# EAGLE design breakout2.1 (EAGLE 8.7.0)
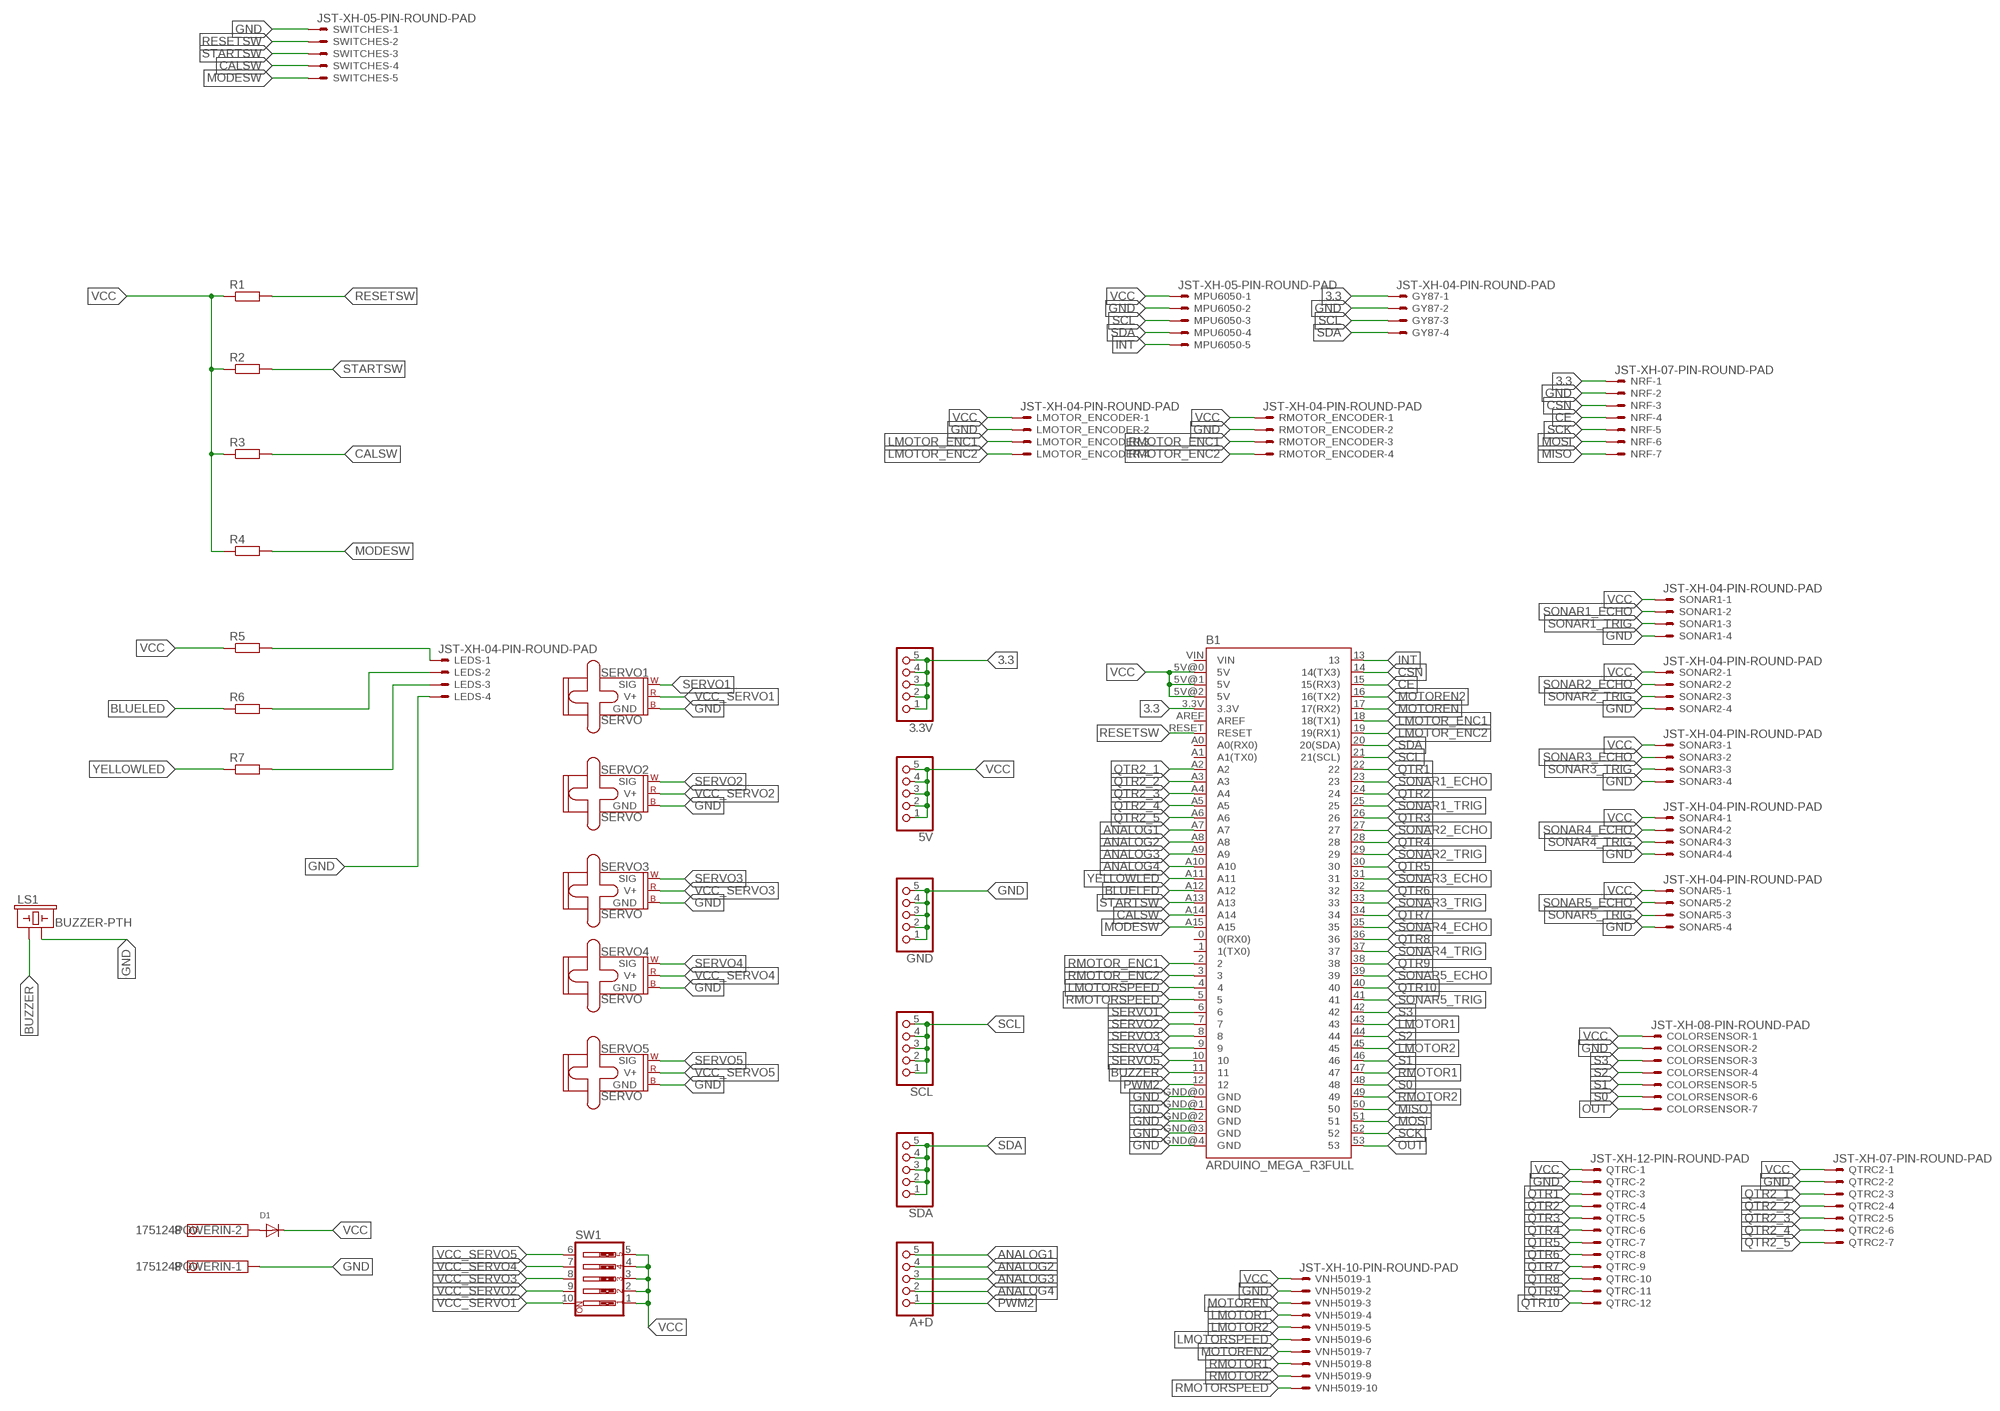
[diagram p0: schematic, sheet 1]

## Parts
3.3V  PINHD-1X55X2MM  [1_05X2MM]
5V  PINHD-1X55X2MM  [1_05X2MM]
A+D  PINHD-1X55X2MM  [1_05X2MM]
B1  ARDUINO_MEGA_R3FULL  [ARDUINO_MEGA]
COLORSENSOR  JST-XH-08-PIN-ROUND-PAD  [JST-XH-08-PACKAGE-ROUND-PAD]
D1  DIODEDO-1N4148  [DO-1N4148]
GND  PINHD-1X55X2MM  [1_05X2MM]
GY87  JST-XH-04-PIN-ROUND-PAD  [JST-XH-04-PACKAGE-ROUND-PAD]
LEDS  JST-XH-04-PIN-ROUND-PAD  [JST-XH-04-PACKAGE-ROUND-PAD]
LMOTOR_ENCODER  JST-XH-04-PIN-ROUND-PAD  [JST-XH-04-PACKAGE-ROUND-PAD]
LS1  BUZZER-PTH  [BUZZER-12MM]
MPU6050  JST-XH-05-PIN-ROUND-PAD  [JST-XH-05-PACKAGE-ROUND-PAD]
NRF  JST-XH-07-PIN-ROUND-PAD  [JST-XH-07-PACKAGE-ROUND-PAD]
POWERIN  1751248  [1751248]
QTRC  JST-XH-12-PIN-ROUND-PAD  [JST-XH-12-PACKAGE-ROUND-PAD]
QTRC2  JST-XH-07-PIN-ROUND-PAD  [JST-XH-07-PACKAGE-ROUND-PAD]
R1  R-EU_0204/7  [0204/7]
R2  R-EU_0204/7  [0204/7]
R3  R-EU_0204/7  [0204/7]
R4  R-EU_0204/7  [0204/7]
R5  R-EU_0204/7  [0204/7]
R6  R-EU_0204/7  [0204/7]
R7  R-EU_0204/7  [0204/7]
RMOTOR_ENCODER  JST-XH-04-PIN-ROUND-PAD  [JST-XH-04-PACKAGE-ROUND-PAD]
SCL  PINHD-1X55X2MM  [1_05X2MM]
SDA  PINHD-1X55X2MM  [1_05X2MM]
SERVO1  SERVO  [1X03]
SERVO2  SERVO  [1X03]
SERVO3  SERVO  [1X03]
SERVO4  SERVO  [1X03]
SERVO5  SERVO  [1X03]
SONAR1  JST-XH-04-PIN-ROUND-PAD  [JST-XH-04-PACKAGE-ROUND-PAD]
SONAR2  JST-XH-04-PIN-ROUND-PAD  [JST-XH-04-PACKAGE-ROUND-PAD]
SONAR3  JST-XH-04-PIN-ROUND-PAD  [JST-XH-04-PACKAGE-ROUND-PAD]
SONAR4  JST-XH-04-PIN-ROUND-PAD  [JST-XH-04-PACKAGE-ROUND-PAD]
SONAR5  JST-XH-04-PIN-ROUND-PAD  [JST-XH-04-PACKAGE-ROUND-PAD]
SW1  SW_DIP-5  [EDG-05]
SWITCHES  JST-XH-05-PIN-ROUND-PAD  [JST-XH-05-PACKAGE-ROUND-PAD]
VNH5019  JST-XH-10-PIN-ROUND-PAD  [JST-XH-10-PACKAGE-ROUND-PAD]

## Nets
3.3: 3.3V.1 3.3V.2 3.3V.3 3.3V.4 3.3V.5 B1.3.3V GY87.1 NRF.1
ANALOG1: A+D.5 B1.A7
ANALOG2: A+D.4 B1.A8
ANALOG3: A+D.3 B1.A9
ANALOG4: A+D.2 B1.A10
BLUELED: B1.A12 R6.1
BUZZER: B1.11 LS1.+
CALSW: B1.A14 R3.2 SWITCHES.4
CE: B1.15(15(RX3)) NRF.4
CSN: B1.14(14(TX3)) NRF.3
GND: B1.GND@0(GND) B1.GND@1(GND) B1.GND@2(GND) B1.GND@3(GND) B1.GND@4(GND) COLORSENSOR.2 GND.1 GND.2 GND.3 GND.4 GND.5 GY87.2 LEDS.4 LMOTOR_ENCODER.2 LS1.- MPU6050.2 NRF.2 POWERIN.1 QTRC2.2 QTRC.2 RMOTOR_ENCODER.2 SERVO1.3(GND) SERVO2.3(GND) SERVO3.3(GND) SERVO4.3(GND) SERVO5.3(GND) SONAR1.4 SONAR2.4 SONAR3.4 SONAR4.4 SONAR5.4 SWITCHES.1 VNH5019.2
INT: B1.13 MPU6050.5
LMOTOR1: B1.43 VNH5019.4
LMOTOR2: B1.45 VNH5019.5
LMOTOR_ENC1: B1.18(18(TX1)) LMOTOR_ENCODER.3
LMOTOR_ENC2: B1.19(19(RX1)) LMOTOR_ENCODER.4
LMOTORSPEED: B1.4 VNH5019.6
MISO: B1.50 NRF.7
MODESW: B1.A15 R4.2 SWITCHES.5
MOSI: B1.51 NRF.6
MOTOREN: B1.17(17(RX2)) VNH5019.3
MOTOREN2: B1.16(16(TX2)) VNH5019.7
N$1: D1.A POWERIN.2
N$3: LEDS.2 R6.2
N$5: LEDS.3 R7.2
N$6: LEDS.1 R5.2
OUT: B1.53 COLORSENSOR.7
PWM2: A+D.1 B1.12
QTR1: B1.22 QTRC.3
QTR2: B1.24 QTRC.4
QTR2_1: B1.A2 QTRC2.3
QTR2_2: B1.A3 QTRC2.4
QTR2_3: B1.A4 QTRC2.5
QTR2_4: B1.A5 QTRC2.6
QTR2_5: B1.A6 QTRC2.7
QTR3: B1.26 QTRC.5
QTR4: B1.28 QTRC.6
QTR5: B1.30 QTRC.7
QTR6: B1.32 QTRC.8
QTR7: B1.34 QTRC.9
QTR8: B1.36 QTRC.10
QTR9: B1.38 QTRC.11
QTR10: B1.40 QTRC.12
RESETSW: B1.RESET R1.2 SWITCHES.2
RMOTOR1: B1.47 VNH5019.8
RMOTOR2: B1.49 VNH5019.9
RMOTOR_ENC1: B1.2 RMOTOR_ENCODER.3
RMOTOR_ENC2: B1.3 RMOTOR_ENCODER.4
RMOTORSPEED: B1.5 VNH5019.10
S0: B1.48 COLORSENSOR.6
S1: B1.46 COLORSENSOR.5
S2: B1.44 COLORSENSOR.4
S3: B1.42 COLORSENSOR.3
SCK: B1.52 NRF.5
SCL: B1.21(21(SCL)) GY87.3 MPU6050.3 SCL.1 SCL.2 SCL.3 SCL.4 SCL.5
SDA: B1.20(20(SDA)) GY87.4 MPU6050.4 SDA.1 SDA.2 SDA.3 SDA.4 SDA.5
SERVO1: B1.6 SERVO1.1(SIG)
SERVO2: B1.7 SERVO2.1(SIG)
SERVO3: B1.8 SERVO3.1(SIG)
SERVO4: B1.9 SERVO4.1(SIG)
SERVO5: B1.10 SERVO5.1(SIG)
SONAR1_ECHO: B1.23 SONAR1.2
SONAR1_TRIG: B1.25 SONAR1.3
SONAR2_ECHO: B1.27 SONAR2.2
SONAR2_TRIG: B1.29 SONAR2.3
SONAR3_ECHO: B1.31 SONAR3.2
SONAR3_TRIG: B1.33 SONAR3.3
SONAR4_ECHO: B1.35 SONAR4.2
SONAR4_TRIG: B1.37 SONAR4.3
SONAR5_ECHO: B1.39 SONAR5.2
SONAR5_TRIG: B1.41 SONAR5.3
STARTSW: B1.A13 R2.2 SWITCHES.3
VCC: 5V.1 5V.2 5V.3 5V.4 5V.5 B1.5V@0(5V) B1.5V@1(5V) B1.5V@2(5V) COLORSENSOR.1 D1.C LMOTOR_ENCODER.1 MPU6050.1 QTRC2.1 QTRC.1 R1.1 R2.1 R3.1 R4.1 R5.1 RMOTOR_ENCODER.1 SONAR1.1 SONAR2.1 SONAR3.1 SONAR4.1 SONAR5.1 SW1.1 SW1.2 SW1.3 SW1.4 SW1.5 VNH5019.1
VCC_SERVO1: SERVO1.2(V+) SW1.10
VCC_SERVO2: SERVO2.2(V+) SW1.9
VCC_SERVO3: SERVO3.2(V+) SW1.8
VCC_SERVO4: SERVO4.2(V+) SW1.7
VCC_SERVO5: SERVO5.2(V+) SW1.6
YELLOWLED: B1.A11 R7.1
Unconnected: B1.0(0(RX0)) B1.1(1(TX0)) B1.A0(A0(RX0)) B1.A1(A1(TX0)) B1.AREF B1.VIN COLORSENSOR.8

## Library data of the parts
3.3V 5V A+D GND SCL SDA = pinhead:PINHD-1X5: PIN HEADER
B1 = SparkFun-Boards:ARDUINO_MEGA_R3: Arduino Mega R3 ATmega2560 R3 compatible footprint. SparkFun Products: Arduino Mega 2560 R3 <https://www.sparkfun.com/products/11061>
COLORSENSOR = Rembrandt Electronics - JST XH Connectors v1-0:JST-XH-08-PIN: JST XH Connector 2 Pin Wire to board connector. Pitch: 2,54 mm, (0.100") Number of pins: 8 Created by Rembrandt Electronics www.rembrandtelectronics.com
D1 = adafruit:DIODE: Diode SMADIODE - SMA Surface Mount Package 20V 1A Schottky Diode Digikey: 641-1014-6-ND DO-1N4148 - Through Hole Small Current Diode SOD-123 20V 1 A (.5mV Vf) Schottky Diode - Digikey: MBRX120TPMSCT-ND SOD-323 10V 570mA (.38mV Vf, 3ns) Schottky Diode - Digikey: ZLLS410CT-ND SOD-523 30V 30mA Schottky Diode (RB751S-40TE61) - Digikey: RB751S-40TE61CT-ND SOT23-R/W - SOT23 Package (R = Solder Paste/Reflow Ovens, W = Hand-Soldering) BAT54Film 40V 300mA - Digikey: 497-7162-1-ND
GY87 LEDS LMOTOR_ENCODER RMOTOR_ENCODER SONAR1-SONAR5 = Rembrandt Electronics - JST XH Connectors v1-0:JST-XH-04-PIN: JST XH Connector 2 Pin Wire to board connector. Pitch: 2,54 mm, (0.100") Number of pins: 4 Created by Rembrandt Electronics www.rembrandtelectronics.com
LS1 = SparkFun-Electromechanical:BUZZER: Buzzer Small round buzzers that operate around the audible 2kHz range. You can use these as speakers to create simple music or user interfaces. Variant Overview: PTH - Mini Speaker - PC Mount 12mm 2.048kHz <https://www.sparkfun.com/products/7950> PTH_KIT - Mini Speaker - PC Mount 12mm 2.048kHz <https://www.sparkfun.com/products/7950> KIT simplifies soldering by adding stop mask to one side of the pads. PTH_NO_SILK - Mini Speaker - PC Mount 12mm 2.048kHz <https://www.sparkfun.com/products/7950> No silkscreen indicator of buzzer outline. PTH_KIT_NO_SILK - Mini Speaker - PC Mount 12mm 2.048kHz <https://www.sparkfun.com/products/7950> KIT package w/o silkscreen SMD - Buzzer Audio Magnetic (CCV-084B16) SMD buzzer used on, e.g. the LilyPad Buzzer <https://www.sparkfun.com/products/8463> and RFID USB Reader <https://www.sparkfun.com/products/9963>. SMD_KIT - Buzzer Audio Magnetic (CCV-084B16) SMD Buzzer with elongated pins to make soldering easier. Used on the SparkFun Simon Says - Surface Mount Soldering Kit <https://www.sparkfun.com/products/10935>.; PROD_ID: COMP-08253; SF_SKU: COM-07950
MPU6050 SWITCHES = Rembrandt Electronics - JST XH Connectors v1-0:JST-XH-05-PIN: JST XH Connector 2 Pin Wire to board connector. Pitch: 2,54 mm, (0.100") Number of pins: 5 Created by Rembrandt Electronics www.rembrandtelectronics.com
NRF QTRC2 = Rembrandt Electronics - JST XH Connectors v1-0:JST-XH-07-PIN: JST XH Connector 2 Pin Wire to board connector. Pitch: 2,54 mm, (0.100") Number of pins: 7 Created by Rembrandt Electronics www.rembrandtelectronics.com
POWERIN = con-phoenix-350:1751248: MKDS 1/ 2-3,5 Printklemme Nennstrom: 10 A Bemessungsspannung: 160 V Raster: 3,5 mm Polzahl: 2 Montageart: Löten Anschlussart: Schraubanschluss Anschlussrichtung vom Leiter zur Platine: 0° Source: http://eshop.phoenixcontact.com .. 1751248.pdf; OC_FARNELL: unknown; OC_NEWARK: unknown
QTRC = Rembrandt Electronics - JST XH Connectors v1-0:JST-XH-12-PIN: JST XH Connector 2 Pin Wire to board connector. Pitch: 2,54 mm, (0.100") Number of pins: 12 Created by Rembrandt Electronics www.rembrandtelectronics.com
R1-R7 = rcl:R-EU_: RESISTOR, European symbol
SERVO1-SERVO5 = SparkFun-Electromechanical:SERVO: Servo Motor 3-pin connector for a standard servo motor (voltage supply, ground, and control signal.) SparkFun Products Servo - Generic (Sub-Micro Size) <https://www.sparkfun.com/products/9065> (ROB-09065) Servo - Generic High Torque Continuous Rotation (Standard Size) <https://www.sparkfun.com/products/9347> (ROB-09347) Servo - Generic High Torque (Standard Size) <https://www.sparkfun.com/products/11965> (ROB-11965)
SW1 = special:SW_DIP-5: DIP SWITCH
VNH5019 = Rembrandt Electronics - JST XH Connectors v1-0:JST-XH-10-PIN: JST XH Connector 2 Pin Wire to board connector. Pitch: 2,54 mm, (0.100") Number of pins: 10 Created by Rembrandt Electronics www.rembrandtelectronics.com

## Board
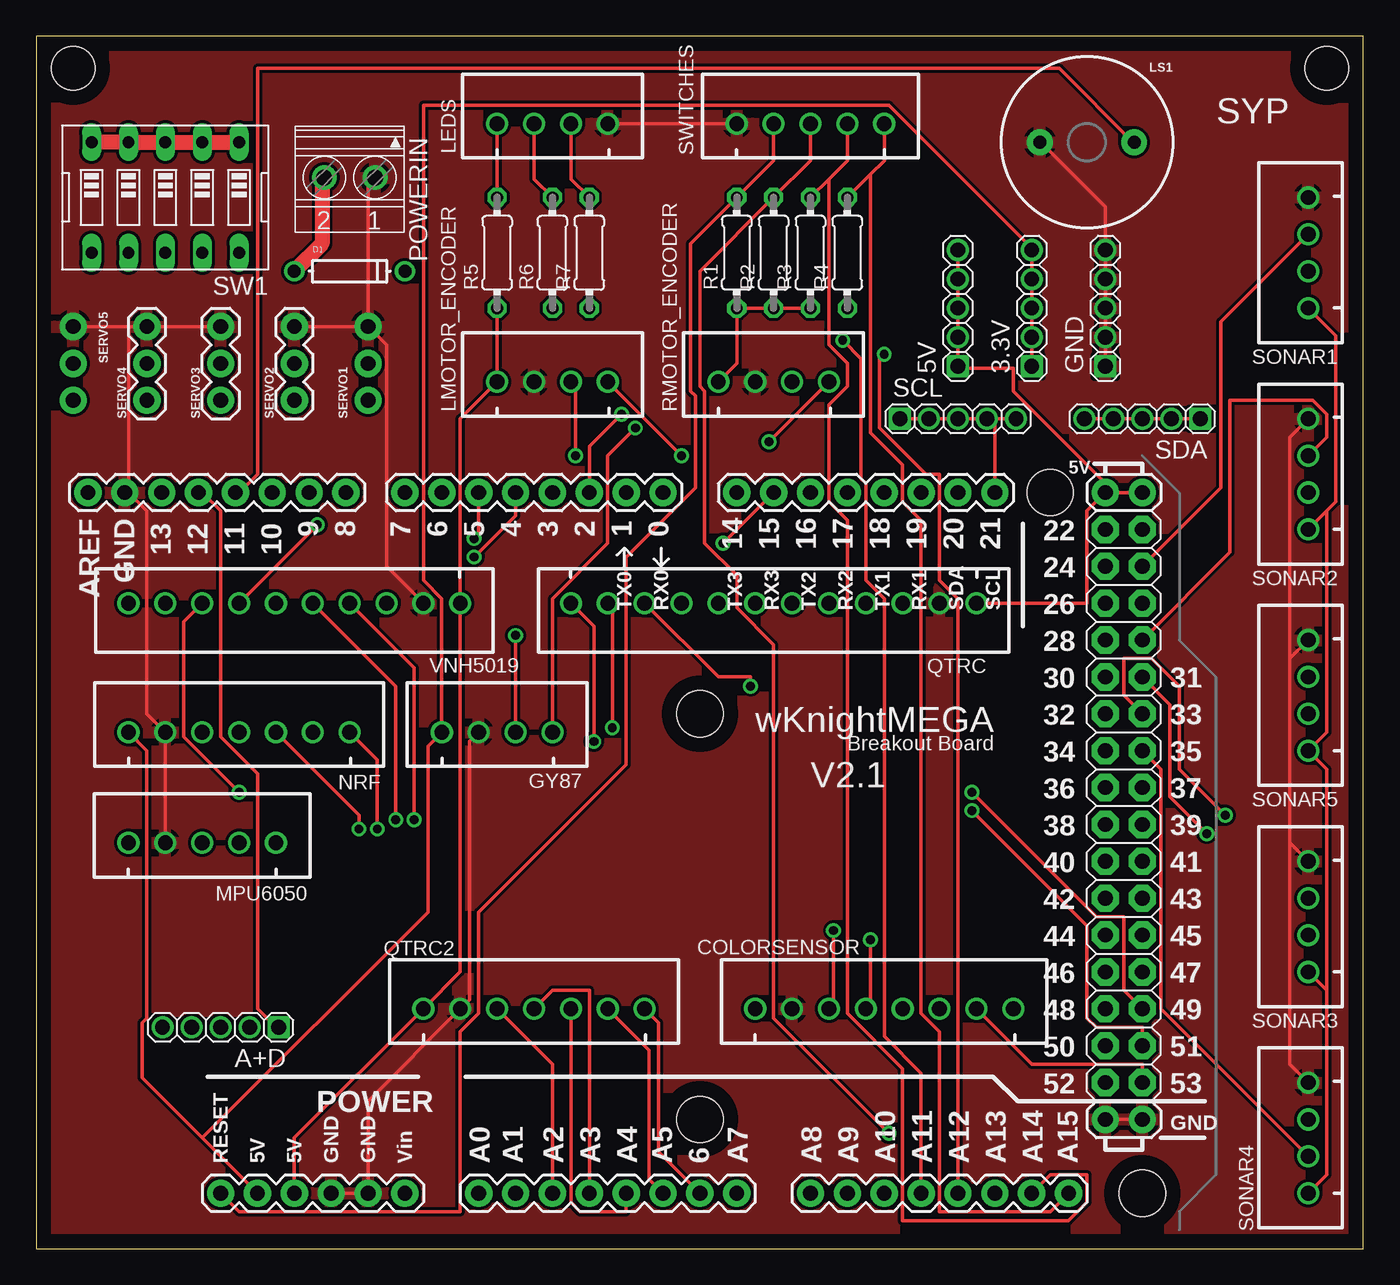
[diagram p1: board, top side]
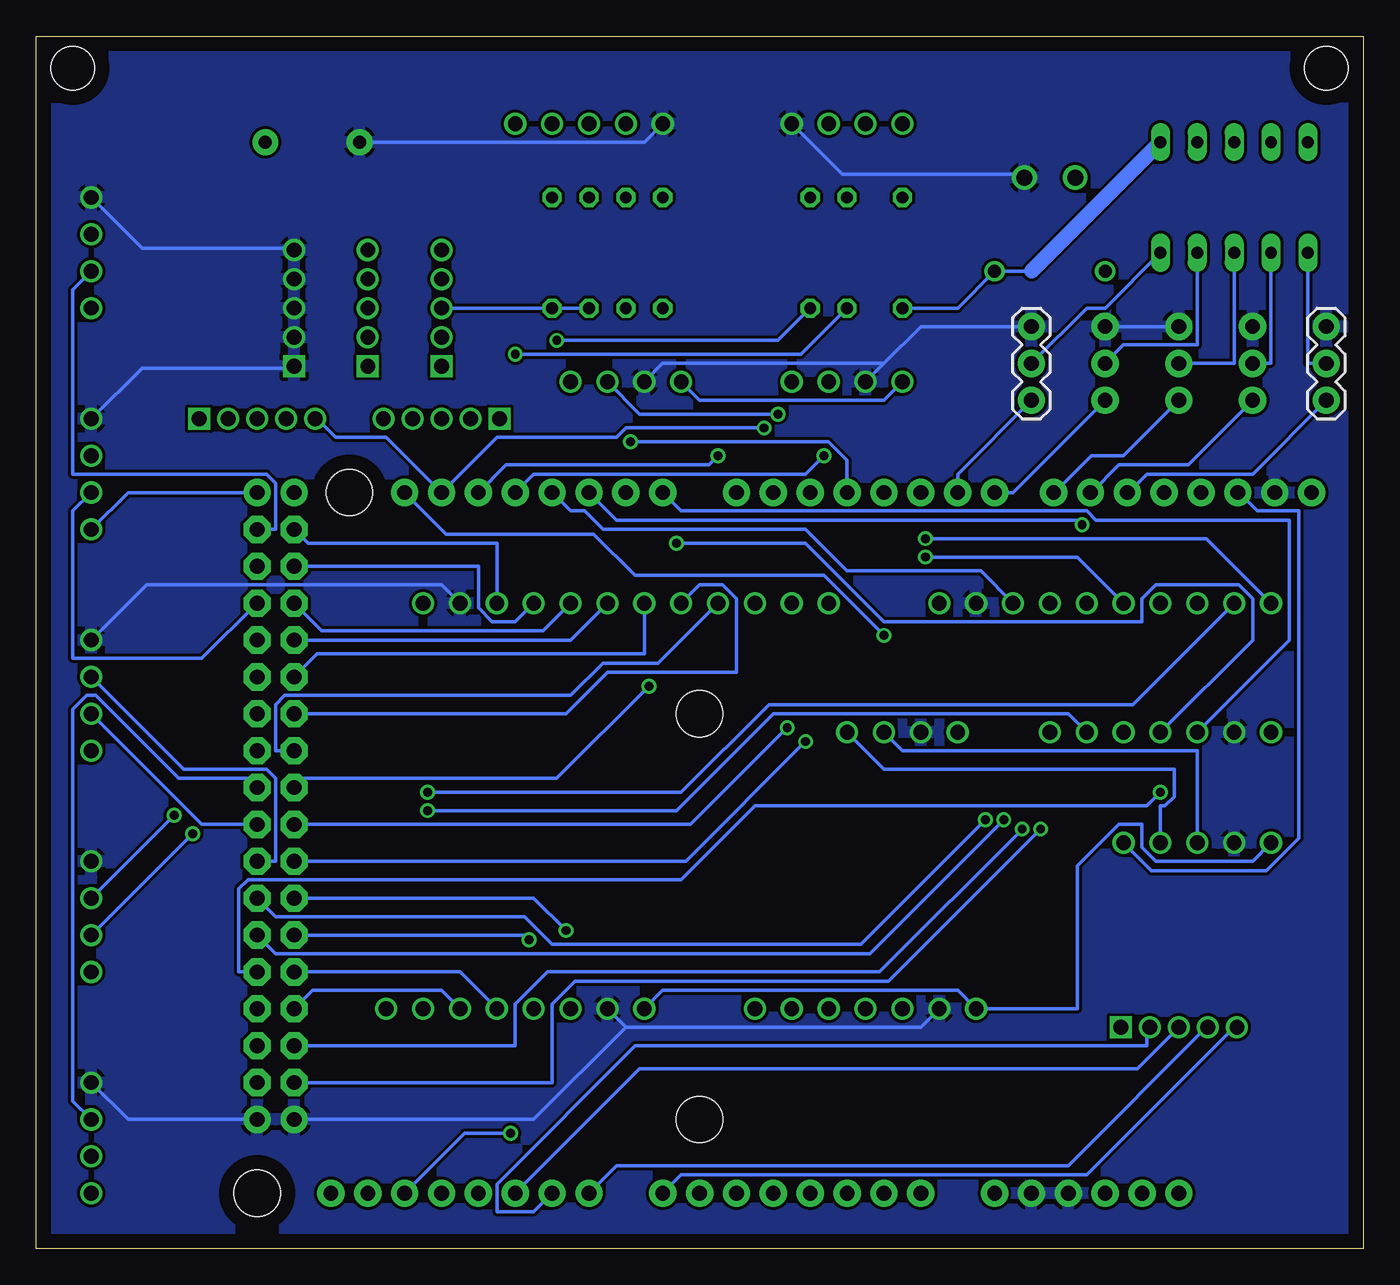
[diagram p2: board, bottom side, seen from below]

Size 91.42 x 83.49 mm. Coordinates in mm from the lower left corner, seen from the top.
Outline: 0,0 91.42,0 91.42,83.49 0,83.49 0,0
Copper layers (1*16): Top 0.035mm / dielectric 1.5mm / Bottom 0.035mm
Design rules "default": minimum track width 10mil, minimum drill 24mil, track to track 8mil, track to pad 8mil, pad to pad 8mil, via to via 8mil, smd to smd 8mil, copper to edge 40mil, drill to drill 8mil, minimum pad ring 10mil, minimum via ring 8mil, stop-mask expansion 4mil, vias tented up to drill 0mil, thermal gap 10mil
Holes 3 mm at 88.9,81.28 2.54,81.28

### Footprints (pad centres in the part's own frame; a part is rotated, then mirrored left to right if it is on the bottom)
1_05X2MM = drill 1.016 pad 1.3 square: 1 -4,0 | drill 1.016 pad 1.3: 2 0,0; 3 -2,0; 4 2,0; 5 4,0
ARDUINO_MEGA = drill 1.016 pad 1.88: 0 13.97,24.13; 1 11.43,24.13; 2 8.89,24.13; 3 6.35,24.13; 3.3V -13.97,-24.13; 4 3.81,24.13; 5 1.27,24.13; 5V@0 -11.43,-24.13; 5V@1 44.45,24.13; 5V@2 46.99,24.13; 6 -1.27,24.13; 7 -3.81,24.13; 8 -7.874,24.13; 9 -10.414,24.13; 10 -12.954,24.13; 11 -15.494,24.13; 12 -18.034,24.13; 13 -20.574,24.13; 14 19.05,24.13; 15 21.59,24.13; 16 24.13,24.13; 17 26.67,24.13; 18 29.21,24.13; 19 31.75,24.13; 20 34.29,24.13; 21 36.83,24.13; A0 1.27,-24.13; A1 3.81,-24.13; A2 6.35,-24.13; A3 8.89,-24.13; A4 11.43,-24.13; A5 13.97,-24.13; A6 16.51,-24.13; A7 19.05,-24.13; A8 24.13,-24.13; A9 26.67,-24.13; A10 29.21,-24.13; A11 31.75,-24.13; A12 34.29,-24.13; A13 36.83,-24.13; A14 39.37,-24.13; A15 41.91,-24.13; AREF -25.654,24.13; GND@0 -8.89,-24.13; GND@1 -6.35,-24.13; GND@2 44.45,-19.05; GND@3 46.99,-19.05; GND@4 -23.114,24.13; RESET -16.51,-24.13; VIN -3.81,-24.13 | drill 1.016 pad 1.88 octagon: 22 44.45,21.59; 23 46.99,21.59; 24 44.45,19.05; 25 46.99,19.05; 26 44.45,16.51; 27 46.99,16.51; 28 44.45,13.97; 29 46.99,13.97; 30 44.45,11.43; 31 46.99,11.43; 32 44.45,8.89; 33 46.99,8.89; 34 44.45,6.35; 35 46.99,6.35; 36 44.45,3.81; 37 46.99,3.81; 38 44.45,1.27; 39 46.99,1.27; 40 44.45,-1.27; 41 46.99,-1.27; 42 44.45,-3.81; 43 46.99,-3.81; 44 44.45,-6.35; 45 46.99,-6.35; 46 44.45,-8.89; 47 46.99,-8.89; 48 44.45,-11.43; 49 46.99,-11.43; 50 44.45,-13.97; 51 46.99,-13.97; 52 44.45,-16.51; 53 46.99,-16.51 | hole 3.2: 16.51,8.89; 16.51,-19.05; 40.64,24.13; 46.99,-24.13
JST-XH-08-PACKAGE-ROUND-PAD = drill 1.016: 1 -8.89,0; 2 -6.35,0; 3 -3.81,0; 4 -1.27,0; 5 1.27,0; 6 3.81,0; 7 6.35,0; 8 8.89,0
DO-1N4148 = drill 0.9: A -3.81,0; C 3.81,0
JST-XH-04-PACKAGE-ROUND-PAD = drill 1.016: 1 -3.81,0; 2 -1.27,0; 3 1.27,0; 4 3.81,0
BUZZER-12MM = drill 0.9 pad 1.778: + 3.25,0; - -3.25,0
JST-XH-05-PACKAGE-ROUND-PAD = drill 1.016: 1 -5.08,0; 2 -2.54,0; 3 0,0; 4 2.54,0; 5 5.08,0
JST-XH-07-PACKAGE-ROUND-PAD = drill 1.016: 1 -7.62,0; 2 -5.08,0; 3 -2.54,0; 4 0,0; 5 2.54,0; 6 5.08,0; 7 7.62,0
1751248 = drill 1.1 pad 1.7: 1 -1.75,-0.1; 2 1.75,-0.1
JST-XH-12-PACKAGE-ROUND-PAD = drill 1.016: 1 -13.97,0; 2 -11.43,0; 3 -8.89,0; 4 -6.35,0; 5 -3.81,0; 6 -1.27,0; 7 1.27,0; 8 3.81,0; 9 6.35,0; 10 8.89,0; 11 11.43,0; 12 13.97,0
0204/7 = drill 0.813 octagon: 1 -3.81,0; 2 3.81,0
1X03 = drill 1.016 pad 1.88: 1 0,0; 2 2.54,0; 3 5.08,0
EDG-05 = drill 0.813 long: 1 -5.08,-3.81; 2 -2.54,-3.81; 3 0,-3.81; 4 2.54,-3.81; 5 5.08,-3.81; 6 5.08,3.81; 7 2.54,3.81; 8 0,3.81; 9 -2.54,3.81; 10 -5.08,3.81
JST-XH-10-PACKAGE-ROUND-PAD = drill 1.016: 1 -11.43,0; 2 -8.89,0; 3 -6.35,0; 4 -3.81,0; 5 -1.27,0; 6 1.27,0; 7 3.81,0; 8 6.35,0; 9 8.89,0; 10 11.43,0

### Placement (x,y rotation side)
3.3V  68.58,64.77 90 top
5V  63.5,64.77 90 top
A+D  12.7,15.24 180 top
B1  29.21,27.94 0 top
COLORSENSOR  58.42,16.51 0 top
D1  21.59,67.31 0 top
GND  73.66,64.77 90 top
GY87  31.75,35.56 0 top
LEDS  35.56,77.47 0 top
LMOTOR_ENCODER  35.56,59.69 0 top
LS1  72.39,76.2 0 top
MPU6050  11.43,27.94 0 top
NRF  13.97,35.56 0 top
POWERIN  21.59,73.66 180 top
QTRC  50.8,44.45 180 top
QTRC2  34.29,16.51 0 top
R1  48.26,68.58 90 top
R2  50.8,68.58 90 top
R3  53.34,68.58 90 top
R4  55.88,68.58 90 top
R5  31.75,68.58 90 top
R6  35.56,68.58 90 top
R7  38.1,68.58 90 top
RMOTOR_ENCODER  50.8,59.69 0 top
SCL  63.5,57.15 0 top
SDA  76.2,57.15 180 top
SERVO1  22.86,58.42 90 bottom
SERVO2  17.78,58.42 90 top
SERVO3  12.7,58.42 90 top
SERVO4  7.62,58.42 90 top
SERVO5  2.54,58.42 90 bottom
SONAR1  87.63,68.58 90 top
SONAR2  87.63,53.34 90 top
SONAR3  87.63,22.86 90 top
SONAR4  87.63,7.62 90 top
SONAR5  87.63,38.1 90 top
SW1  8.89,72.39 180 top
SWITCHES  53.34,77.47 0 top
VNH5019  17.78,44.45 180 top

### Tracks (layer width: path | path; a pad name or v marks a point on that pad's centre or on a via)
3.3
  Top 0.254: 3.3V.1 3.3V.3 3.3V.2 3.3V.4 3.3V.5 68.58,68.9 58.74,78.74 26.67,78.74 26.67,46.04 27.94,44.77 GY87.1 26.99,34.61 26.99,23.18 11.43,7.62 | NRF.1 7.62,34.29 7.62,15.88 7.3,15.56 7.3,11.75 11.43,7.62 | B1.3.3V 11.43,7.62
ANALOG1
  Bottom 0.254: B1.A7 46.99,5.08 19.05,5.08 8.89,15.24 A+D.5
ANALOG2
  Bottom 0.254: B1.A8 51.44,5.71 20.32,5.71 10.79,15.24 A+D.4
ANALOG3
  Bottom 0.254: B1.A9 57.15,2.54 59.69,2.54 59.69,4.45 50.16,13.97 14.92,13.97 14.92,15.24 A+D.3
ANALOG4
  Bottom 0.254: A+D.2 15.56,12.38 49.85,12.38 B1.A10
BLUELED  (via drill 0.61)
  Top 0.254: v58.42,61.59 58.1,61.28 58.1,56.51 61.28,53.34 62.23,53.34 62.23,46.04 63.5,44.77 B1.A12
  Bottom 0.254: R6.1 38.73,61.59 v58.42,61.59
BUZZER
  Top 0.254: LS1.+ 75.56,76.2 70.48,81.28 15.24,81.28 15.24,53.34 13.97,52.07 B1.11
CALSW
  Top 0.254: 54.61,73.66 55.88,74.93 SWITCHES.4 | 54.61,73.66 R3.2 | B1.A14 69.85,5.08 72.39,5.08 72.39,3.18 71.12,1.9 59.69,1.9 59.69,12.38 55.88,16.19 55.88,50.16 54.61,51.43 54.61,58.1 55.88,59.37 55.88,60.96 54.61,62.23 54.61,73.66
CE  (via drill 0.61)
  Top 0.254: B1.15 v47.31,48.58
  Bottom 0.254: NRF.4 7.62,41.91 7.62,44.77 8.57,45.72 14.29,45.72 15.24,44.77 15.24,43.18 33.02,43.18 38.42,48.58 v47.31,48.58
CSN
  Bottom 0.254: NRF.3 5.08,41.91 5.08,50.16 18.41,50.16 19.05,50.8 46.99,50.8 B1.14
GND
  Top 0.254: MPU6050.2 NRF.2 7.62,36.83 7.62,50.8 6.35,52.07 | 6.35,63.5 SERVO4.3 SERVO3.3 | 6.35,63.5 SERVO5.3 | 6.35,63.5 6.35,52.07 | 6.35,52.07 B1.GND@4 | SWITCHES.1 LEDS.4 | VNH5019.2 24.13,46.99 24.13,62.23 SERVO1.3 | SERVO1.3 22.86,73.34 23.18,73.66 POWERIN.1 | SERVO1.3 SERVO2.3 | GY87.2 29.84,34.92 29.84,17.14 QTRC2.2 22.86,10.16 B1.GND@1 B1.GND@0 | GND.1 GND.3 GND.2 GND.4 GND.5 73.66,71.76 69.22,76.2 LS1.- | B1.GND@3 B1.GND@2 | 86.36,27.94 SONAR3.4 | 86.36,40.64 86.36,27.94 | SONAR5.4 86.36,40.64 | SONAR4.4 86.36,12.7 86.36,27.94 | SONAR2.4 86.36,55.88 86.36,40.64
  Bottom 0.254: 33.02,60.96 30.48,63.5 SERVO1.3 | 33.02,60.96 LMOTOR_ENCODER.2 | RMOTOR_ENCODER.2 48.26,60.96 33.02,60.96 | LEDS.4 35.88,73.98 23.5,73.98 POWERIN.1 | SERVO2.3 SERVO3.3 | 50.8,15.24 COLORSENSOR.2 | 50.8,15.24 30.48,15.24 QTRC2.2 | SONAR2.4 84.14,60.64 73.66,60.64 GND.1 | SONAR1.4 84.14,68.9 73.66,68.9 GND.5 | SONAR4.4 85.09,8.89 B1.GND@3 | QTRC.2 63.5,45.72 83.82,45.72 SONAR5.4 | 50.8,15.24 57.15,8.89 B1.GND@2 | SWITCHES.1 49.53,76.2 LS1.-
  pour Bottom: -5.08,86.36 100.33,86.36 100.33,-7.62 -5.08,-7.62
  pour Top: -3.81,86.36 95.25,86.36 95.25,-5.08 -3.81,-5.08
INT
  Bottom 0.254: MPU6050.5 14.61,26.04 6.67,26.04 4.45,28.26 4.45,50.8 7.3,50.8 8.57,52.07 B1.13
LMOTOR1  (via drill 0.61)
  Top 0.254: VNH5019.4 26.04,40 v26.04,29.53
  Bottom 0.254: v26.04,29.53 34.61,20.96 55.88,20.96 57.78,22.86 74.93,22.86 B1.43
LMOTOR2  (via drill 0.61)
  Top 0.254: VNH5019.5 24.77,38.73 v24.77,29.53
  Bottom 0.254: v24.77,29.53 33.97,20.32 74.93,20.32 B1.45
LMOTOR_ENC1  (via drill 0.61)
  Top 0.254: LMOTOR_ENCODER.3 37.15,59.37 v37.15,54.61
  Bottom 0.254: v37.15,54.61 38.42,53.34 57.15,53.34 B1.18
LMOTOR_ENC2  (via drill 0.61)
  Top 0.254: v44.45,54.61 LMOTOR_ENCODER.4
  Bottom 0.254: v44.45,54.61 45.09,53.97 59.05,53.97 B1.19
LMOTORSPEED  (via drill 0.61)
  Top 0.254: v30.16,47.62 33.02,50.48 B1.4
  Bottom 0.254: VNH5019.6 19.68,47.62 v30.16,47.62
MISO  (via drill 0.61)
  Top 0.254: NRF.7 23.5,33.65 v23.5,28.89
  Bottom 0.254: v23.5,28.89 33.34,19.05 56.2,19.05 58.42,16.83 58.42,13.97 B1.50
MODESW
  Top 0.254: 57.47,73.98 58.42,74.93 SWITCHES.5 | 57.47,73.98 R4.2 | B1.A15 69.85,2.54 62.23,2.54 62.23,14.92 60.96,16.19 60.96,50.16 59.69,51.43 59.69,53.97 57.47,56.2 57.47,73.98
MOSI  (via drill 0.61)
  Top 0.254: v64.45,30.16 72.39,22.23 72.39,15.88 73.03,15.24 76.2,15.24 B1.51
  Bottom 0.254: NRF.6 20.32,36.83 40.64,36.83 47.31,30.16 v64.45,30.16
MOTOREN
  Bottom 0.254: VNH5019.3 26.35,46.67 35.56,46.67 38.42,49.53 52.39,49.53 53.66,50.8 54.61,50.8 B1.17
MOTOREN2  (via drill 0.61)
  Top 0.254: v19.37,49.85 VNH5019.7
  Bottom 0.254: v19.37,49.85 19.68,50.16 51.44,50.16 B1.16
N$1
  Top 0.254: 19.68,73.66 POWERIN.2
  Top 1.016: D1.A 19.68,69.22 19.68,73.66
N$3
  Top 0.254: R6.2 34.29,73.66 LEDS.2
N$5
  Top 0.254: R7.2 36.83,73.66 LEDS.3
N$6
  Top 0.254: LEDS.1 R5.2
OUT
  Top 0.254: COLORSENSOR.7 68.58,12.7 76.2,12.7 B1.53
PWM2
  Top 0.254: A+D.1 16.51,15.24 15.24,16.51 15.24,32.7 12.7,35.24 12.7,50.8 11.43,52.07 B1.12
QTR1
  Bottom 0.254: QTRC.3 59.69,48.58 72.71,48.58 B1.22
QTR2
  Bottom 0.254: QTRC.4 58.42,43.18 60.01,43.18 60.96,44.13 60.96,46.99 B1.24
QTR2_1
  Top 0.254: QTRC2.3 35.56,12.7 B1.A2
QTR2_2
  Top 0.254: QTRC2.4 35.56,17.78 38.1,17.78 B1.A3
QTR2_3
  Top 0.254: QTRC2.5 36.83,3.18 37.47,2.54 40.64,2.54 B1.A4
QTR2_4
  Top 0.254: QTRC2.6 42.23,13.65 42.23,4.76 B1.A5
QTR2_5
  Top 0.254: QTRC2.7 42.86,15.56 42.86,6.67 B1.A6
QTR3
  Bottom 0.254: QTRC.5 56.52,42.54 71.75,42.54 B1.26
QTR4
  Bottom 0.254: QTRC.6 54.61,41.91 B1.28
QTR5
  Bottom 0.254: QTRC.7 49.53,40.96 72.07,40.96 B1.30
QTR6
  Bottom 0.254: QTRC.8 45.72,45.72 44.13,45.72 43.18,44.77 43.18,39.69 52.07,39.69 54.93,36.83 B1.32
QTR7
  Bottom 0.254: QTRC.9 48.58,40.32 52.39,40.32 54.61,38.1 74.3,38.1 74.93,37.46 74.93,34.29 B1.34
QTR8  (via drill 0.61)
  Top 0.254: QTRC.10 46.99,39.37 49.21,39.37 v49.21,38.73
  Bottom 0.254: v49.21,38.73 55.56,32.38 73.03,32.38 B1.36
QTR9  (via drill 0.61)
  Top 0.254: QTRC.11 39.69,44.13 v39.69,35.88
  Bottom 0.254: v39.69,35.88 46.35,29.21 B1.38
QTR10  (via drill 0.61)
  Top 0.254: QTRC.12 38.42,42.86 v38.42,34.92
  Bottom 0.254: v38.42,34.92 46.67,26.67 B1.40
RESETSW
  Top 0.254: SWITCHES.2 50.8,74.93 R1.2 45.09,69.22 45.09,59.05 45.4,58.74 45.4,52.39 40.64,47.62 40.64,33.34 30.48,23.18 30.48,16.19 29.21,14.92 29.21,2.54 13.97,2.54 B1.RESET
RMOTOR1  (via drill 0.61)
  Top 0.254: VNH5019.8 10.16,43.18 10.16,35.24 v13.97,31.43
  Bottom 0.254: v13.97,31.43 14.92,30.48 41.91,30.48 46.99,25.4 76.83,25.4 77.47,24.77 77.47,19.05 B1.47
RMOTOR2  (via drill 0.61)
  Top 0.254: v64.45,31.43 73.03,22.86 74.93,22.86 74.93,17.78 B1.49
  Bottom 0.254: VNH5019.9 15.88,37.46 40.96,37.46 46.99,31.43 v64.45,31.43
RMOTOR_ENC1  (via drill 0.61)
  Top 0.254: v40.32,57.47 38.1,55.24 B1.2
  Bottom 0.254: RMOTOR_ENCODER.3 49.85,57.47 v40.32,57.47
RMOTOR_ENC2  (via drill 0.61)
  Top 0.254: v50.48,55.56 RMOTOR_ENCODER.4
  Bottom 0.254: v50.48,55.56 36.83,55.56 35.56,54.29 B1.3
RMOTORSPEED  (via drill 0.61)
  Top 0.254: v30.16,48.89 30.48,49.21 B1.5
  Bottom 0.254: VNH5019.10 10.79,48.89 v30.16,48.89
S0
  Bottom 0.254: COLORSENSOR.6 63.5,17.78 72.39,17.78 B1.48
S1
  Bottom 0.254: COLORSENSOR.5 62.23,19.05 B1.46
S2  (via drill 0.61)
  Top 0.254: COLORSENSOR.4 57.47,16.83 v57.47,21.27
  Bottom 0.254: v57.47,21.27 57.78,21.59 B1.44
S3  (via drill 0.61)
  Top 0.254: COLORSENSOR.3 54.93,16.83 v54.93,21.91
  Bottom 0.254: v54.93,21.91 57.15,24.13 B1.42
SCK  (via drill 0.61)
  Top 0.254: NRF.5 22.23,29.84 v22.23,28.89
  Bottom 0.254: v22.23,28.89 32.7,18.41 54.29,18.41 55.88,16.83 55.88,11.43 B1.52
SCL  (via drill 0.61)
  Top 0.254: SCL.5 66.04,57.15 | SCL.1 SCL.3 SCL.2 SCL.4 66.04,57.15 | 66.04,57.15 B1.21 | GY87.3 v33.02,42.23
  Bottom 0.254: MPU6050.3 11.43,34.29 31.75,34.29 GY87.3 | B1.21 63.18,49.21 53.02,49.21 50.16,46.35 37.15,46.35 v33.02,42.23
SDA  (via drill 0.61)
  Top 0.254: SDA.1 SDA.3 SDA.2 SDA.4 SDA.5 | v41.27,56.51 39.37,54.61 39.37,48.58 35.56,44.77 GY87.4
  Bottom 0.254: SDA.5 72.07,57.15 70.8,55.88 67.31,55.88 B1.20 59.69,55.88 51.44,55.88 50.8,56.51 v41.27,56.51 | MPU6050.4 13.97,30.48 13.65,30.48 13.02,31.11 13.02,33.02 33.02,33.02 GY87.4
SERVO1
  Bottom 0.254: SERVO1.1 27.94,53.34 B1.6
SERVO2
  Bottom 0.254: SERVO2.1 24.13,52.07 B1.7
SERVO3
  Bottom 0.254: SERVO3.1 16.51,54.61 18.73,54.61 21.27,52.07 B1.8
SERVO4
  Bottom 0.254: SERVO4.1 12.06,53.97 16.83,53.97 18.73,52.07 B1.9
SERVO5
  Bottom 0.254: SERVO5.1 7.62,53.34 14.92,53.34 16.19,52.07 B1.10
SONAR1_ECHO
  Bottom 0.254: SONAR1.2 88.9,66.04 88.9,53.34 75.56,53.34 74.93,52.7 74.93,49.53 B1.23
SONAR1_TRIG
  Top 0.254: SONAR1.3 81.6,63.82 81.6,52.39 B1.25
SONAR2_ECHO
  Bottom 0.254: SONAR2.2 88.9,50.8 88.9,40.64 80.01,40.64 B1.27
SONAR2_TRIG
  Top 0.254: SONAR2.3 88.9,55.88 88.9,57.47 87.95,58.42 82.23,58.42 82.23,47.94 B1.29
SONAR3_ECHO  (via drill 0.61)
  Top 0.254: v80.64,28.57 78.11,31.11 78.11,37.46 B1.31
  Bottom 0.254: v80.64,28.57 SONAR3.2
SONAR3_TRIG  (via drill 0.61)
  Top 0.254: v81.92,29.84 78.74,33.02 78.74,38.73 76.83,40.64 74.93,40.64 74.93,38.1 B1.33
  Bottom 0.254: v81.92,29.84 SONAR3.3
SONAR4_ECHO
  Top 0.254: SONAR4.2 77.47,16.51 77.47,33.02 B1.35
SONAR4_TRIG
  Bottom 0.254: SONAR4.3 88.9,10.16 88.9,37.15 87.95,38.1 87.31,38.1 81.6,32.38 76.83,32.38 B1.37
SONAR5_ECHO
  Bottom 0.254: SONAR5.2 80.01,29.21 B1.39
SONAR5_TRIG
  Bottom 0.254: SONAR5.3 81.28,33.02 75.56,33.02 74.93,32.38 74.93,26.67 B1.41
STARTSW  (via drill 0.61)
  Top 0.254: SWITCHES.3 53.34,74.93 R2.2 45.72,67.31 45.72,59.37 46.04,59.05 46.04,48.58 48.26,46.35 48.26,44.13 50.8,41.59 50.8,15.88 v58.74,7.94
  Bottom 0.254: B1.A13 61.91,7.94 v58.74,7.94
VCC
  Top 0.254: B1.5V@0 17.78,7.62 QTRC2.1 29.21,19.05 VNH5019.1 29.21,57.15 LMOTOR_ENCODER.1 R5.1 | SONAR4.1 88.9,5.08 88.9,17.78 | SONAR3.1 88.9,17.78 | 88.9,17.78 88.9,33.02 SONAR5.1 88.9,35.56 88.9,50.8 | 5V.5 5V.4 5V.2 5V.3 5V.1 63.5,60.64 67.31,60.64 67.31,59.05 73.66,52.7 B1.5V@1 | R3.1 R2.1 R1.1 48.26,60.96 RMOTOR_ENCODER.1 | QTRC.1 72.39,44.45 72.39,50.8 B1.5V@1 | SONAR1.1 89.53,62.87 89.53,51.43 88.9,50.8 | SONAR2.1 88.9,50.8 | B1.5V@2 B1.5V@1
  Top 1.016: SW1.5 SW1.4 SW1.3 SW1.2 SW1.1
  Bottom 0.254: MPU6050.1 7.62,26.67 14.29,26.67 15.24,27.62 15.24,29.21 16.83,29.21 19.68,26.35 19.68,16.51 QTRC2.1 27.94,17.78 48.26,17.78 COLORSENSOR.1 | R5.1 27.94,64.77 D1.C 22.86,67.31 | R3.1 R4.1 5V.2 | SONAR2.1 85.09,52.07 B1.5V@2 | LMOTOR_ENCODER.1 33.02,58.42 45.72,58.42 RMOTOR_ENCODER.1
  Bottom 1.016: 22.86,67.31 SW1.1
VCC_SERVO1
  Bottom 0.254: SW1.10 17.78,64.77 19.05,64.77 SERVO1.2
VCC_SERVO2
  Bottom 0.254: SW1.9 11.43,62.23 16.51,62.23 SERVO2.2
VCC_SERVO3
  Bottom 0.254: SW1.8 8.89,60.96 SERVO3.2
VCC_SERVO4
  Bottom 0.254: SW1.7 6.35,60.96 SERVO4.2
VCC_SERVO5
  Bottom 0.254: SW1.6 3.81,60.96 SERVO5.2
YELLOWLED  (via drill 0.61)
  Top 0.254: v55.56,62.55 56.83,61.28 56.83,53.02 57.15,52.7 57.15,46.04 58.42,44.77 58.42,14.61 60.96,12.07 B1.A11
  Bottom 0.254: R7.1 40.32,62.55 v55.56,62.55

### Text on the board
tPlace: SYP | wKnightMEGA | Breakout Board | V2.1
tDocu: + | -